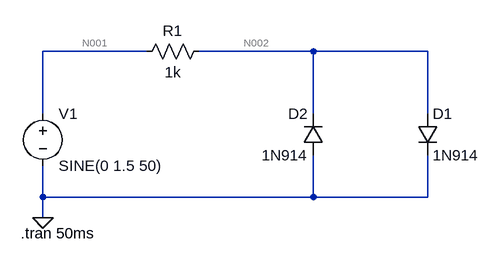
[diagram p0: schematic obmezhuvach.asc]
obmezhuvach.asc, the LTspice schematic file:
Version 4
SHEET 1 880 680
WIRE 224 80 64 80
WIRE 480 80 304 80
WIRE 656 80 480 80
WIRE 64 176 64 80
WIRE 480 176 480 80
WIRE 656 176 656 80
WIRE 64 304 64 256
WIRE 480 304 480 240
WIRE 480 304 64 304
WIRE 656 304 656 240
WIRE 656 304 480 304
WIRE 64 336 64 304
FLAG 64 336 0
SYMBOL res 320 64 R90
WINDOW 0 0 56 VBottom 2
WINDOW 3 32 56 VTop 2
SYMATTR InstName R1
SYMATTR Value 1k
SYMBOL diode 640 176 R0
SYMATTR InstName D1
SYMATTR Value 1N914
SYMBOL diode 496 240 R180
WINDOW 0 24 64 Left 2
WINDOW 3 24 0 Left 2
SYMATTR InstName D2
SYMATTR Value 1N914
SYMBOL voltage 64 160 R0
WINDOW 123 0 0 Left 2
WINDOW 39 0 0 Left 2
SYMATTR InstName V1
SYMATTR Value SINE(0 1.5 50)
TEXT 30 360 Left 2 !.tran 50ms

The netlist it stands for:
* obmezhuvach.asc
R1 N002 N001 1k
D1 N002 0 1N914
D2 0 N002 1N914
V1 N001 0 SINE(0 1.5 50)
.model D D
.lib standard.dio
.tran 50ms
.backanno
.end

* Results of the author's LTspice run, read from the files saved beside the schematic
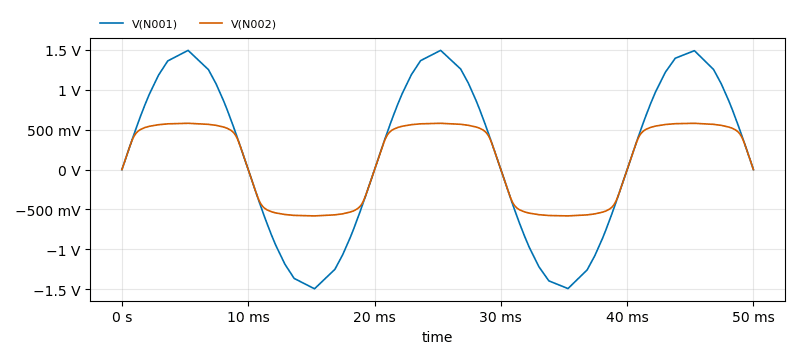
[diagram p1: Transient Analysis of obmezhuvach.asc, plotted from the saved traces]
* Transient Analysis, 1 run:
*   V(N001): min -1.495 V, max 1.495 V, average 188.8 mV, rms 1.049 V, last 0 V
*   V(N002): min -580.8 mV, max 580.8 mV, average 97.1 mV, rms 506.4 mV, last 3.77 µV